# EAGLE design aprs (EAGLE 9.6.2)
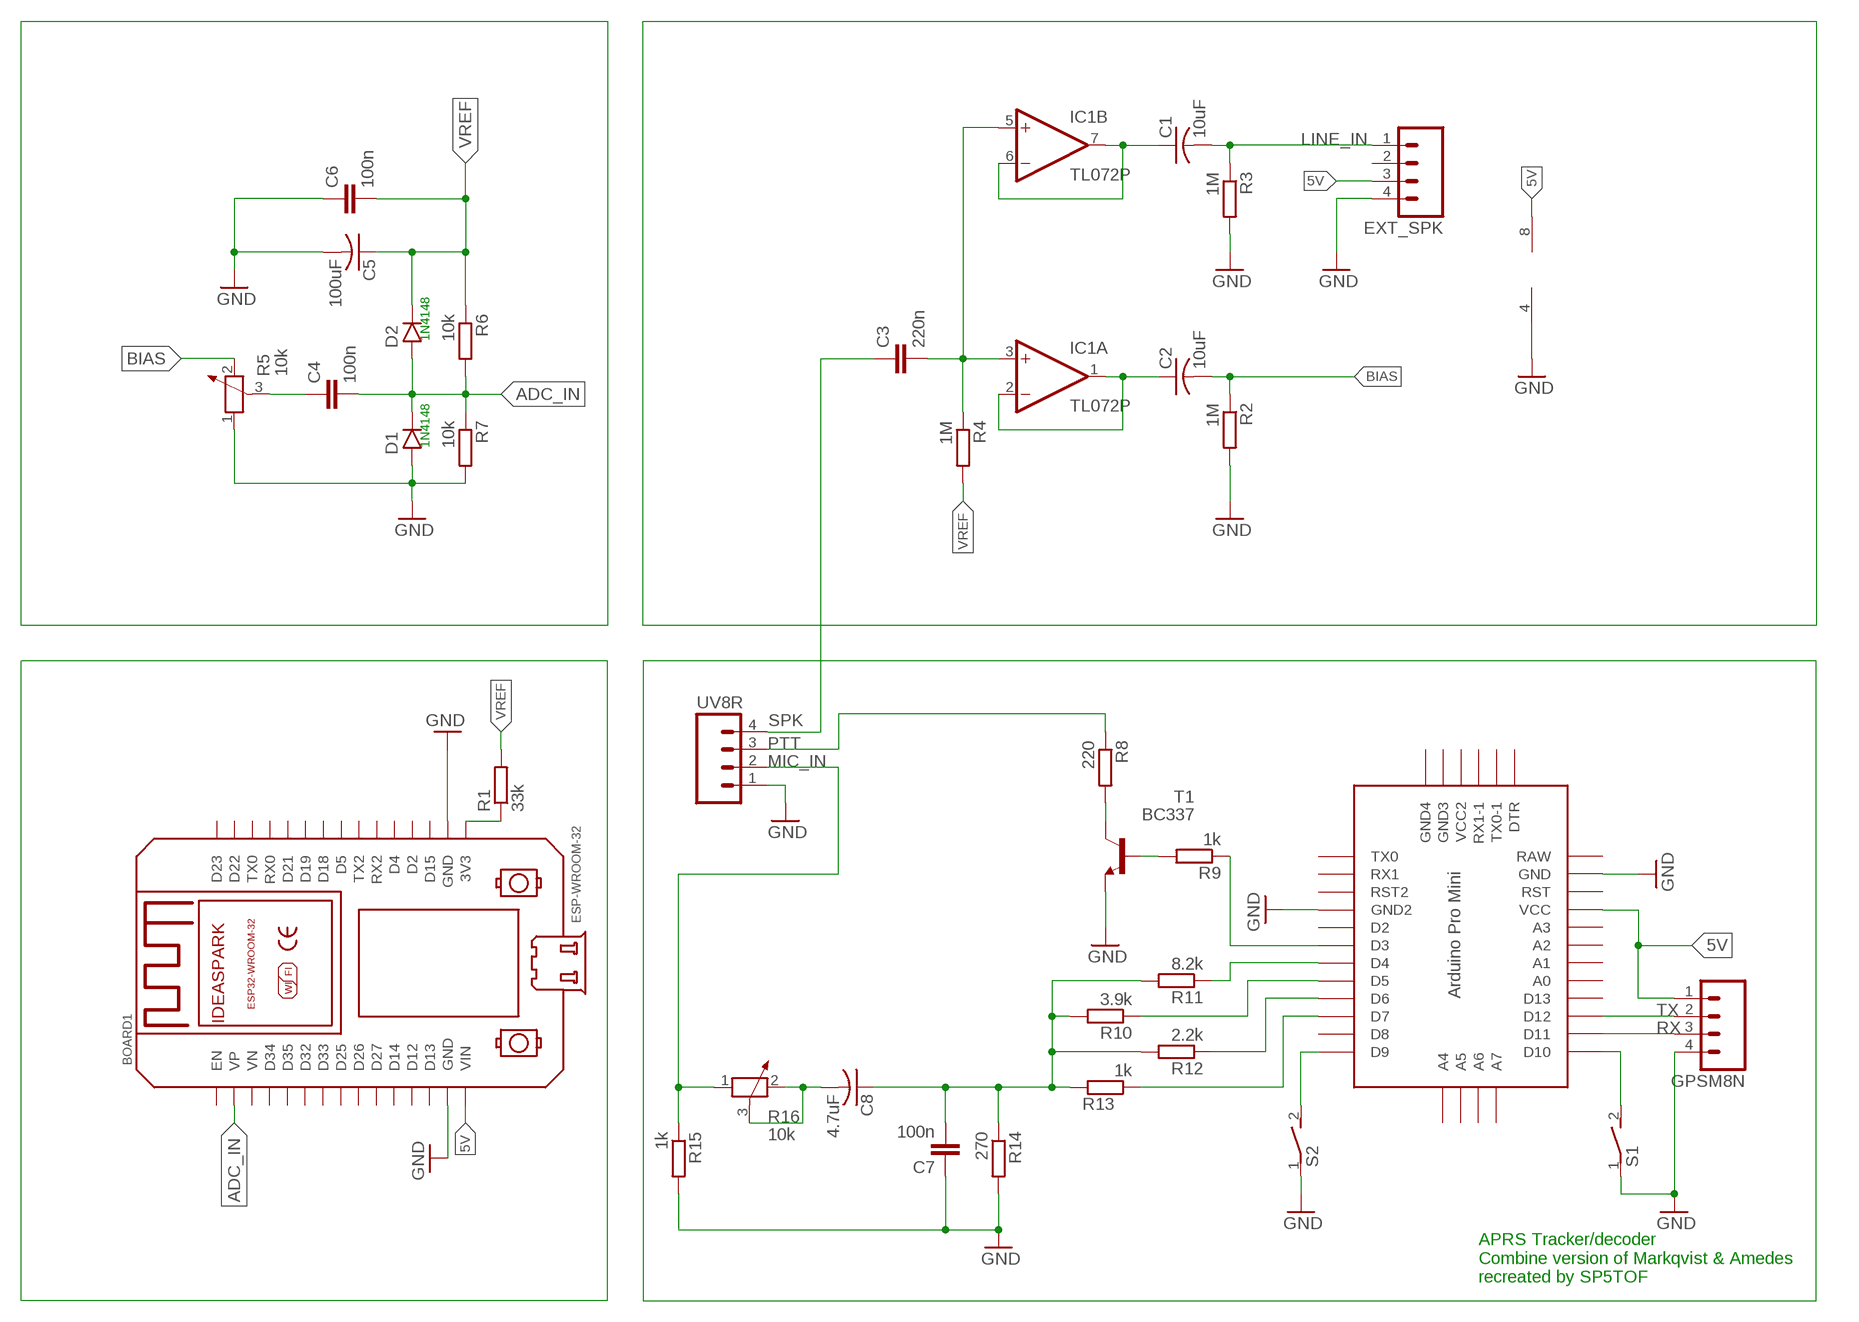
[diagram p0: schematic, sheet 1]

## Parts
BOARD1  ESP32DEVKITV1  [ESP32-DEVKITV1]
C1  10uF  C-US050-035X075  [C050-035X075]
C2  10uF  C-US050-035X075  [C050-035X075]
C3  220n  C-EU025-025X050  [C025-025X050]
C4  100n  C-EU025-025X050  [C025-025X050]
C5  100uF  C-US050-035X075  [C050-035X075]
C6  100n  C-EU025-025X050  [C025-025X050]
C7  100n  C-EU025-025X050  [C025-025X050]
C8  4.7uF  C-US050-035X075  [C050-035X075]
D1  1N4148-3  [DO35-3]
D2  1N4148-3  [DO35-3]
EXT_SPK  M04  [04P]
GPSM8N  M04  [04P]
IC1  TL072P  [DIL08]
R1  33k  R-EU_0207/7  [0207/7]
R2  1M  R-EU_0207/7  [0207/7]
R3  1M  R-EU_0207/7  [0207/7]
R4  1M  R-EU_0207/7  [0207/7]
R5  10k  POTENTIOMETER_PT-10S  [PT-10S]
R6  10k  R-EU_0207/7  [0207/7]
R7  10k  R-EU_0207/7  [0207/7]
R8  220  R-EU_0207/7  [0207/7]
R9  1k  R-EU_0207/7  [0207/7]
R10  3.9k  R-EU_0207/7  [0207/7]
R11  8.2k  R-EU_0207/7  [0207/7]
R12  2.2k  R-EU_0207/7  [0207/7]
R13  1k  R-EU_0207/7  [0207/7]
R14  270  R-EU_0207/7  [0207/7]
R15  1k  R-EU_0207/7  [0207/7]
R16  10k  POTENTIOMETER_PT-10S  [PT-10S]
S1  DS01E  [DS-01]
S2  DS01E  [DS-01]
T1  BC337  [TO92]
U$1  PRO-MINI  [PRO-MINI]
UV8R  M04  [04P]

## Nets
5V: BOARD1.VIN EXT_SPK.3 GPSM8N.1 IC1.8(P:V+) U$1.VCC
ADC_IN: BOARD1.VP C4.2 D1.C D2.A R6.2 R7.1
BIAS: C2.2 R2.1 R5.2
GND: BOARD1.GND BOARD1.GND@1(GND) C5.2 C6.1 C7.1 D1.A EXT_SPK.4 GPSM8N.4 IC1.4(P:V-) R2.2 R3.2 R5.1 R7.2 R14.2 R15.2 S1.1 S2.1 T1.1(E) U$1.GND U$1.GND1(GND2) UV8R.1
LINE_IN: C1.2 EXT_SPK.1 R3.1
MIC_IN: R15.1 R16.1 UV8R.2
N$1: BOARD1.3V3 R1.1
N$2: C1.1 IC1.6(B:-IN) IC1.7(B:OUT)
N$3: C2.1 IC1.1(A:OUT) IC1.2(A:-IN)
N$4: S2.2 U$1.D9
N$5: C3.2 IC1.3(A:+IN) IC1.5(B:+IN) R4.1
N$9: C4.1 R5.3
N$10: S1.2 U$1.D10
N$11: R9.1 U$1.D3
N$12: R9.2 T1.2(B)
N$13: R8.2 T1.3(C)
N$15: R11.1 U$1.D4
N$16: R10.1 U$1.D5
N$17: R12.1 U$1.D6
N$18: R13.1 U$1.D7
N$19: C7.2 C8.1 R10.2 R11.2 R12.2 R13.2 R14.1
N$20: C8.2 R16.2 R16.3
PTT: R8.1 UV8R.3
RX: GPSM8N.3 U$1.D11
SPK: C3.1 UV8R.4
TX: GPSM8N.2 U$1.D12
VREF: C5.1 C6.2 D2.C R1.2 R4.2 R6.1
Unconnected: BOARD1.D2 BOARD1.D4 BOARD1.D5 BOARD1.D12 BOARD1.D13 BOARD1.D14 BOARD1.D15 BOARD1.D18 BOARD1.D19 BOARD1.D21 BOARD1.D22 BOARD1.D23 BOARD1.D25 BOARD1.D26 BOARD1.D27 BOARD1.D32 BOARD1.D33 BOARD1.D34 BOARD1.D35 BOARD1.EN BOARD1.RX0 BOARD1.RX2 BOARD1.TX0 BOARD1.TX2 BOARD1.VN EXT_SPK.2 U$1.A0 U$1.A1 U$1.A2 U$1.A3 U$1.A4 U$1.A5 U$1.A6 U$1.A7 U$1.D2 U$1.D8 U$1.D13 U$1.DTR U$1.GND2(GND4) U$1.GND3 U$1.RST U$1.RST1(RST2) U$1.RX1 U$1.RX1-1 U$1.TX0 U$1.TX0-1 U$1.VCC1(VCC2)

## Notes on the sheet
- 1N4148
- 1N4148
- APRS Tracker/decoder 
  Combine version of Markqvist & Amedes
  recreated by SP5TOF

## Power pins joined to a net without a drawn wire
RAW: U$1.RAW

## Library data of the parts
BOARD1 = ESP32-DEVKITV1:ESP32DEVKITV1: https://github.com/shridattdudhat
C1 C2 C5 C8 = rcl:C-US: CAPACITOR, American symbol; SPICEPREFIX: C
C3 C4 C6 C7 = rcl:C-EU: CAPACITOR, European symbol; SPICEPREFIX: C
D1 D2 = gm-diodes:1N4148: Fast Switching Diode DO-35 glass case a.k.a. 1N914
EXT_SPK GPSM8N UV8R = con-amp-quick:M04: AMP QUICK CONNECTOR; OC_FARNELL: unknown; OC_NEWARK: unknown
IC1 = gm-ics:TL072: OP AMP
R1-R4 R6-R15 = rcl:R-EU_: RESISTOR, European symbol; SPICEPREFIX: R
R5 R16 = rcl:POTENTIOMETER_: Potentiometer; SPICEMODEL: POT; SPICEPREFIX: X
S1 S2 = switch-dil:DS01E: DIL/CODE SWITCH; OC_FARNELL: unknown; OC_NEWARK: unknown
T1 = transistor:BC337: NPN TRANSISTOR
U$1 = Arduino-clone:PRO-MINI: Arduion Pro Mini Clone V1.0 www.betemcu.cu

## Board
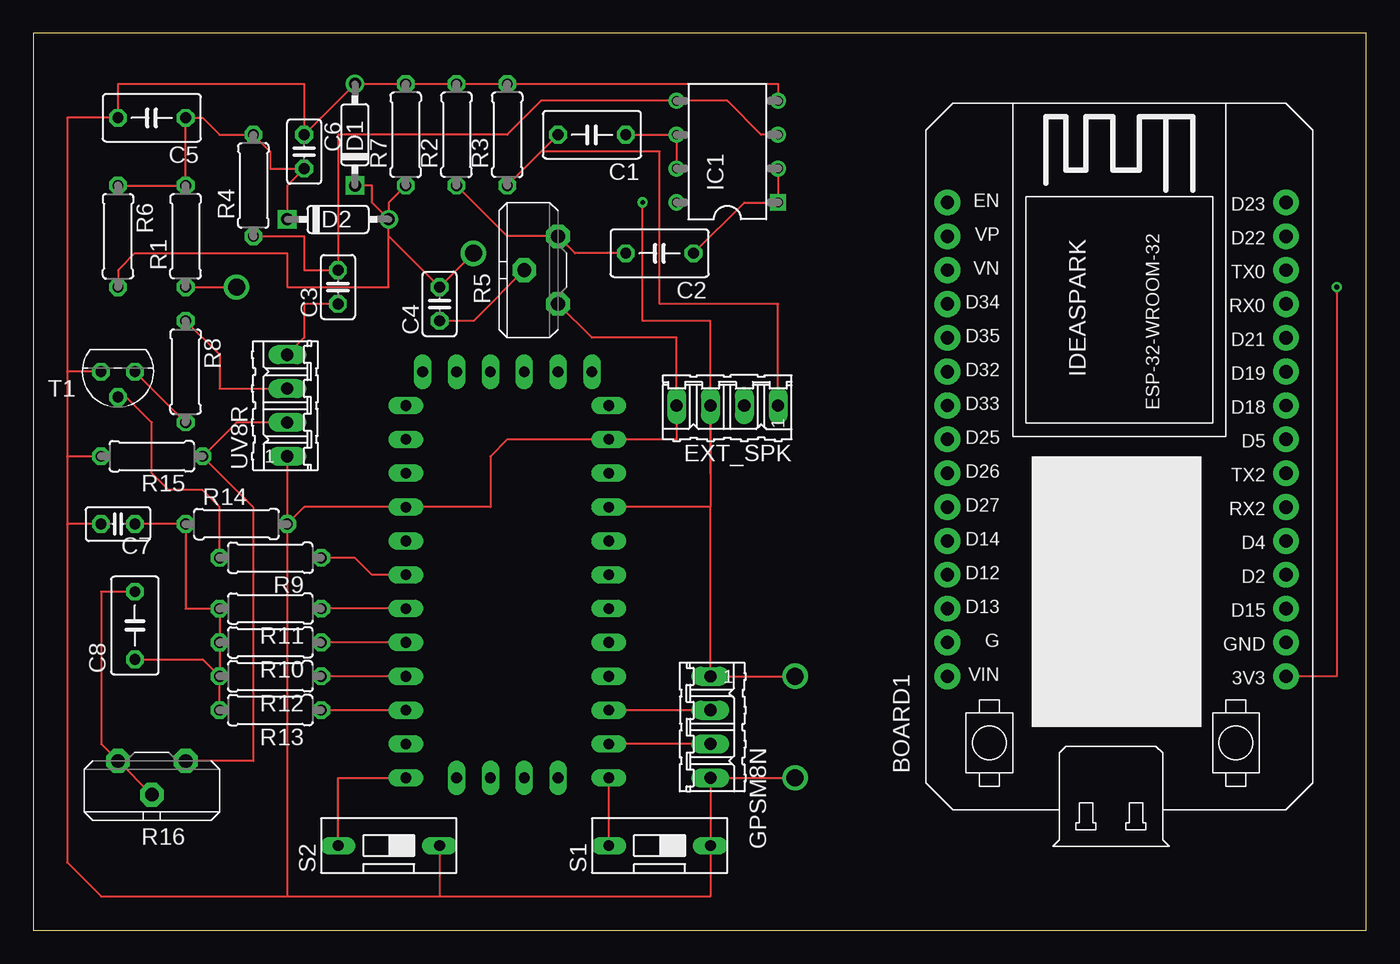
[diagram p1: board, top side]
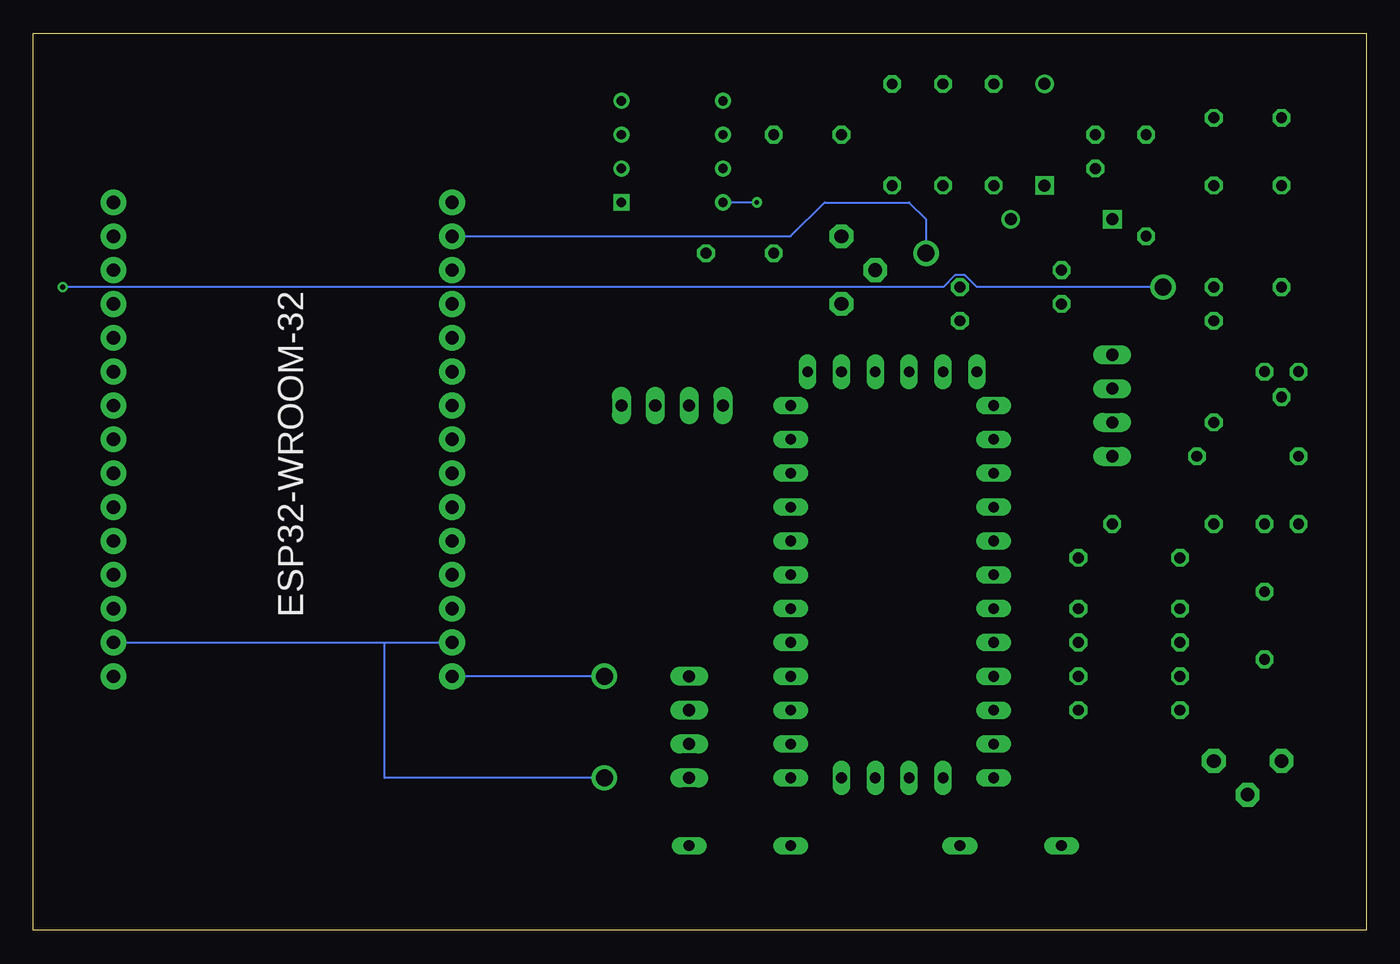
[diagram p2: board, bottom side, seen from below]

Size 100 x 67.3 mm. Coordinates in mm from the lower left corner, seen from the top.
Outline: 0,0 100,0 100,67.3 0,67.3 0,0
Copper layers (1*16): Top 0.035mm / dielectric 1.5mm / Bottom 0.035mm
Design rules "default": minimum track width 6mil, minimum drill 0.35mm, track to track 6mil, track to pad 6mil, pad to pad 6mil, via to via 6mil, smd to smd 6mil, copper to edge 40mil, drill to drill 6mil, minimum pad ring 10mil, minimum via ring 8mil, stop-mask expansion 4mil, vias tented up to drill 0mil, thermal gap 10mil

### Footprints (pad centres in the part's own frame; a part is rotated, then mirrored left to right if it is on the bottom)
ESP32-DEVKITV1 = drill 1 pad 1.93: 3V3 0,0; D2 7.62,0; D4 10.16,0; D5 17.78,0; D12 7.62,25.4; D13 5.08,25.4; D14 10.16,25.4; D15 5.08,0; D18 20.32,0; D19 22.86,0; D21 25.4,0; D22 33.02,0; D23 35.56,0; D25 17.78,25.4; D26 15.24,25.4; D27 12.7,25.4; D32 22.86,25.4; D33 20.32,25.4; D34 27.94,25.4; D35 25.4,25.4; EN 35.56,25.4; GND 2.54,25.4; GND@1 2.54,0; RX0 27.94,0; RX2 12.7,0; TX0 30.48,0; TX2 15.24,0; VIN 0,25.4; VN 30.48,25.4; VP 33.02,25.4
C050-035X075 = drill 0.813 octagon: 1 -2.54,0; 2 2.54,0
C025-025X050 = drill 0.813 octagon: 1 -1.27,0; 2 1.27,0
DO35-3 = drill 0.9: A 3.81,0 | drill 0.9 square: C -3.81,0
04P = drill 0.914 long: 1 -3.81,0; 2 -1.27,0; 3 1.27,0; 4 3.81,0
DIL08 = drill 0.7 square: 1 -3.81,-3.81 | drill 0.7: 2 -1.27,-3.81; 3 1.27,-3.81; 4 3.81,-3.81; 5 3.81,3.81; 6 1.27,3.81; 7 -1.27,3.81; 8 -3.81,3.81
0207/7 = drill 0.813 octagon: 1 -3.81,0; 2 3.81,0
PT-10S = drill 1.016 pad 1.778 octagon: 1 -2.54,-1.27; 2 2.54,-1.27; 3 0,1.27
DS-01 = drill 0.813 long: 1 0,-3.81; 2 0,3.81
TO92 = drill 0.813 octagon: 1 1.27,0; 2 0,1.905; 3 -1.27,0
PRO-MINI = drill 0.8 long: A0 8.89,8.89; A1 8.89,11.43; A2 8.89,13.97; A3 8.89,16.51; A4 -2.54,-1.27; A5 0,-1.27; A6 2.54,-1.27; A7 5.08,-1.27; D2 -6.35,16.51; D3 -6.35,13.97; D4 -6.35,11.43; D5 -6.35,8.89; D6 -6.35,6.35; D7 -6.35,3.81; D8 -6.35,1.27; D9 -6.35,-1.27; D10 8.89,-1.27; D11 8.89,1.27; D12 8.89,3.81; D13 8.89,6.35; DTR 7.62,29.21; GND 8.89,24.13; GND1 -6.35,19.05; GND2 -5.08,29.21; GND3 -2.54,29.21; RAW 8.89,26.67; RST 8.89,21.59; RST1 -6.35,21.59; RX1 -6.35,24.13; RX1-1 2.54,29.21; TX0 -6.35,26.67; TX0-1 5.08,29.21; VCC 8.89,19.05; VCC1 0,29.21

### Placement (x,y rotation side)
BOARD1  93.98,19.05 90 top
C1  41.91,59.69 180 top
C2  46.99,50.8 180 top
C3  22.86,48.26 90 top
C4  30.48,46.99 90 top
C5  8.89,60.96 180 top
C6  20.32,58.42 270 top
C7  6.35,30.48 0 top
C8  7.62,22.86 90 top
D1  24.13,59.69 90 top
D2  22.86,53.34 0 top
EXT_SPK  52.07,39.37 180 top
GPSM8N  50.8,15.24 270 top
IC1  52.07,58.42 90 top
R1  11.43,52.07 90 top
R2  31.75,59.69 90 top
R3  35.56,59.69 90 top
R4  16.51,55.88 90 top
R5  38.1,49.53 90 top
R6  6.35,52.07 270 top
R7  27.94,59.69 90 top
R8  11.43,41.91 270 top
R9  17.78,27.94 180 top
R10  17.78,21.59 180 top
R11  17.78,24.13 180 top
R12  17.78,19.05 180 top
R13  17.78,16.51 180 top
R14  15.24,30.48 0 top
R15  8.89,35.56 180 top
R16  8.89,11.43 180 top
S1  46.99,6.35 90 top
S2  26.67,6.35 90 top
T1  6.35,41.91 180 top
U$1  34.29,12.7 0 top
UV8R  19.05,39.37 90 top

### Tracks (layer width: path | path; a pad name or v marks a point on that pad's centre or on a via)
5V  (via drill 0.35, 1.27)
  Top 0.152: 44.45,31.75 U$1.VCC 50.8,31.75 | 50.8,34.29 EXT_SPK.3 | EXT_SPK.3 50.8,31.75 | 50.8,31.75 GPSM8N.1 v57.15,19.05 | EXT_SPK.3 50.8,45.72 45.72,45.72 v45.72,54.61
  Bottom 0.152: v57.15,19.05 BOARD1.VIN | v45.72,54.61 IC1.8
ADC_IN  (via drill 1.27)
  Top 0.152: 25.4,53.34 D2.A | R7.1 26.67,54.61 D2.A | R6.2 6.35,49.53 7.62,50.8 19.05,50.8 19.05,48.26 26.67,48.26 D2.A | D2.A 26.67,52.07 C4.2 v33.02,50.8 | D2.A 25.4,54.61 25.4,55.88 D1.C
  Bottom 0.152: BOARD1.VP 43.18,52.07 40.64,54.61 34.29,54.61 33.02,53.34 v33.02,50.8
BIAS
  Top 0.152: R2.1 35.56,52.07 R5.2 40.64,50.8 C2.2
GND  (via drill 1.27)
  Top 0.152: 2.54,41.91 2.54,35.56 | 2.54,35.56 2.54,30.48 | 2.54,30.48 2.54,5.08 5.08,2.54 19.05,2.54 | 19.05,2.54 30.48,2.54 | 30.48,2.54 50.8,2.54 S1.1 GPSM8N.4 v57.15,11.43 | T1.1 2.54,41.91 | R15.2 2.54,35.56 | C7.1 2.54,30.48 | R14.2 20.32,31.75 U$1.GND1 34.29,31.75 34.29,35.56 35.56,36.83 U$1.GND 48.26,36.83 EXT_SPK.4 48.26,44.45 41.91,44.45 R5.1 | R14.2 19.05,2.54 | UV8R.1 R14.2 | S2.1 30.48,2.54 | 2.54,41.91 2.54,60.96 C5.2 6.35,63.5 20.32,63.5 C6.1 D1.A R7.2 R2.2 R3.2 55.88,63.5 IC1.4
  Bottom 0.152: v57.15,11.43 73.66,11.43 73.66,21.59 | 73.66,21.59 BOARD1.GND | BOARD1.GND@1 73.66,21.59
LINE_IN
  Top 0.152: C1.2 R3.1 38.1,58.42 46.99,58.42 46.99,46.99 55.88,46.99 EXT_SPK.1
MIC_IN
  Top 0.152: R16.1 16.51,12.7 16.51,31.75 R15.1 15.24,38.1 UV8R.2
N$1  (via drill 0.35, 1.27)
  Top 0.152: R1.1 v15.24,48.26 | v97.79,48.26 97.79,19.05 BOARD1.3V3
  Bottom 0.152: v15.24,48.26 29.22,48.26 30.11,49.15 30.85,49.15 31.74,48.26 v97.79,48.26
N$2
  Top 0.152: IC1.7 IC1.6 C1.1
N$3
  Top 0.152: C2.1 53.34,54.61 IC1.1 IC1.2
N$4
  Top 0.152: S2.2 22.86,11.43 U$1.D9
N$5
  Top 0.152: R4.1 20.32,52.07 20.32,49.53 C3.2 22.86,59.69 35.56,59.69 38.1,62.23 IC1.5 52.07,62.23 54.61,59.69 IC1.3
N$9
  Top 0.152: R5.3 33.02,45.72 C4.1
N$10
  Top 0.152: S1.2 U$1.D10
N$11
  Top 0.152: U$1.D3 25.4,26.67 24.13,27.94 R9.1
N$12
  Top 0.152: R9.2 13.97,31.75 12.7,33.02 10.16,33.02 8.89,34.29 8.89,38.1 6.99,40.01 T1.2
N$13
  Top 0.152: T1.3 R8.2
N$15
  Top 0.152: U$1.D4 R11.1
N$16
  Top 0.152: U$1.D5 R10.1
N$17
  Top 0.152: U$1.D6 R12.1
N$18
  Top 0.152: U$1.D7 R13.1
N$19
  Top 0.152: C7.2 R14.1 11.43,24.13 R11.2 R10.2 R12.2 | R13.2 R12.2 | C8.1 12.7,20.32 R12.2
N$20
  Top 0.152: C8.2 5.08,25.4 5.08,13.97 R16.2 R16.3
PTT
  Top 0.152: R8.1 13.97,43.18 13.97,40.64 UV8R.3
RX
  Top 0.152: GPSM8N.3 U$1.D11
SPK
  Top 0.152: C3.1 20.32,46.99 20.32,44.45 UV8R.4
TX
  Top 0.152: GPSM8N.2 U$1.D12
VREF
  Top 0.152: R6.1 R1.2 C5.1 12.7,60.96 13.97,59.69 R4.2 17.78,58.42 17.78,57.15 C6.2 19.05,55.88 D2.C